# EAGLE design MS5803-02BA (EAGLE 9.1.3)
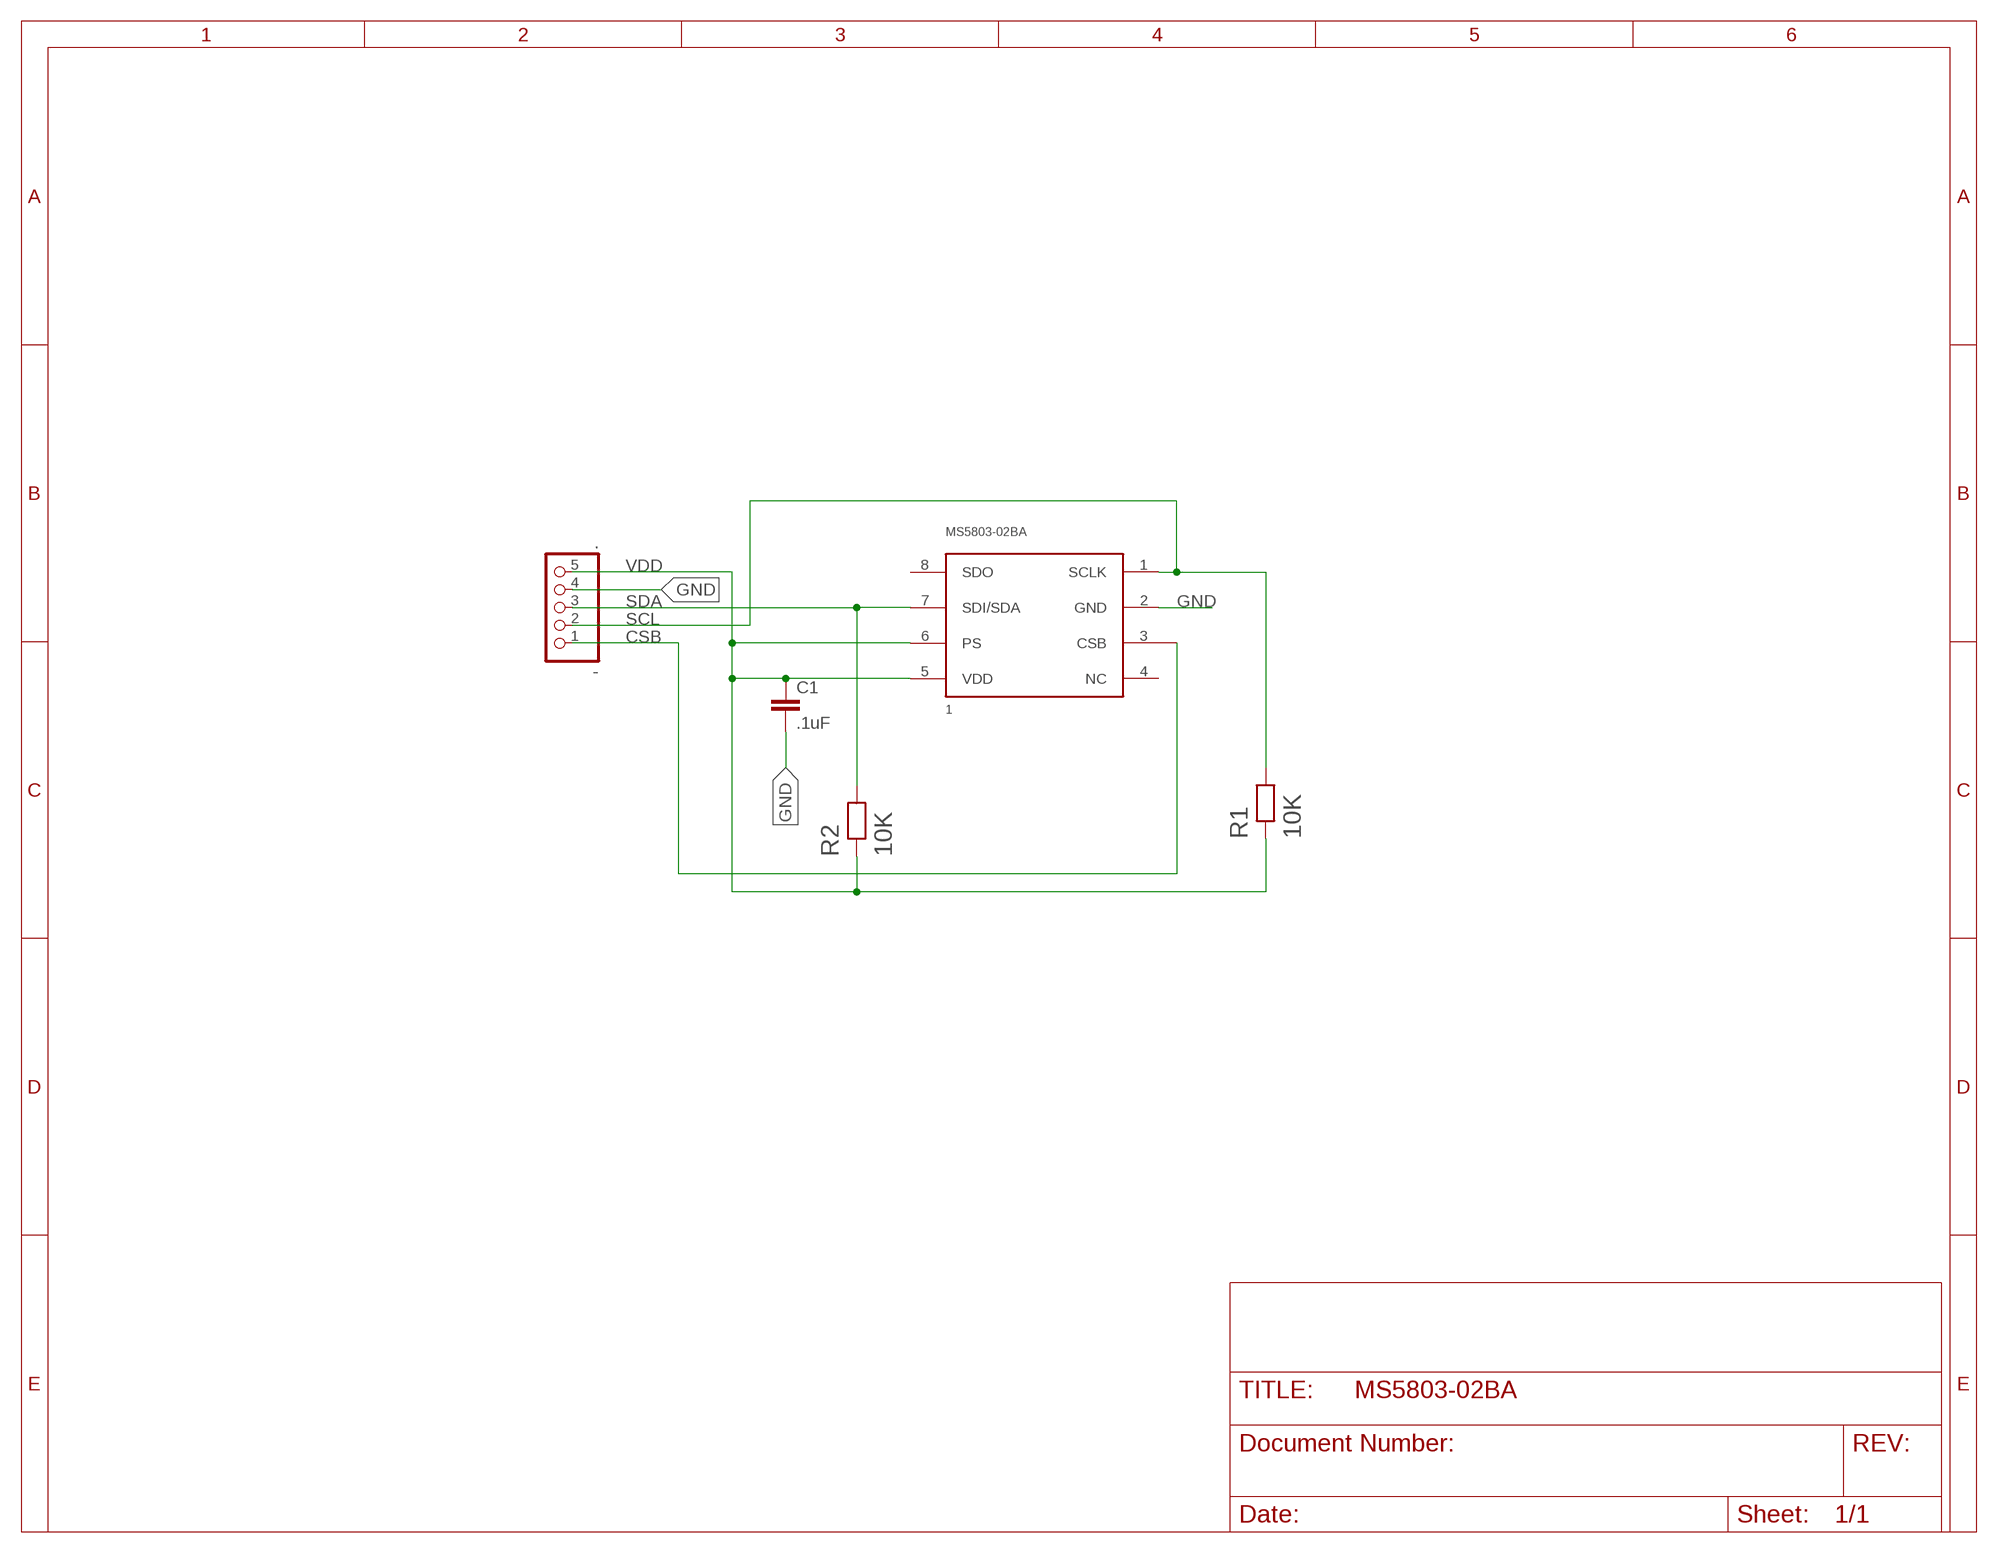
[diagram p0: schematic, sheet 1]

## Parts
-  .  PINHD-1X5  [1X05]
C1  .1uF  C-EUC0805  [C0805]
MS5803-02BA  1  MS5803-02BASMD  [MS5803-02BA]
R1  10K  10KOHM_2012(0805)_SMDSMD  [2012(0805)RESISTOR]
R2  10K  10KOHM_2012(0805)_SMDSMD  [2012(0805)RESISTOR]

## Nets
CSB: -.1 MS5803-02BA.3(CSB)
GND: -.4 C1.2 MS5803-02BA.2(GND)
SCL: -.2 MS5803-02BA.1(SCLK) R1.2
SDA: -.3 MS5803-02BA.7(SDI/SDA) R2.2
VDD: -.5 C1.1 MS5803-02BA.5(VDD) MS5803-02BA.6(PS) R1.1 R2.1
Unconnected: MS5803-02BA.4(NC) MS5803-02BA.8(SDO)

## Library data of the parts
- = pinhead:PINHD-1X5: PIN HEADER
C1 = rcl:C-EU: CAPACITOR, European symbol; SPICEPREFIX: C
MS5803-02BA = OPEnS_Lab_parts:MS5803-02BA: MS5803-02BA Miniature Altimeter Module Specifications High resolution module, 20cm Fast conversion down to 1ms Low power, 1uA (standby < 0.15 uA ) Integrated digital pressure sensor ( 24 bit ΔΣ ADC) Supply voltage 1.8 to 3.6 V Operating range: 300 to 110mbar, -40 to +85°C Extended Pressure Range: 10 to 2000mbar I2C and SPI interface (Mode 0, 3) No external components (Internal Oscillator) Excellent long term stability Hermetically sealable for outdoor devices The MS5803-02BA is a new generation of high resolution altimeter sensors from TE Connectivity with SPI and I2C bus interface. It is optimized for altimeters and variometers with an altitude resolution of 20 cm. The sensor module includes a high linearity pressure sensor and an ultra-low power 24 bit ΔΣ ADC with internal factory calibrated coefficients. It provides a precise digital 24 Bit pressure and temperature value and different operation modes that allow the user to optimize for conversion speed and current consumption. A high resolution temperature output allows the implementation of an altimeter/thermometer function without any additional sensor. The MS5803-02BA can be interfaced to virtually any microcontroller. The communication protocol is simple, without the need of programming internal registers in the device. The gel protection and antimagnetic stainless steel cap allows the use in 100m water resistant altimeter/compass watches. This new sensor module generation is based on leading MEMS technology and latest benefits from TE proven experience and know-how in high volume manufacturing of altimeter modules, which have been widely used for over a decade. The sensing principle employed leads to very low hysteresis and high stability of both pressure and temperature signal.
R1 R2 = OPEnS_Lab_parts:10KOHM_2012(0805)_SMD

## Board
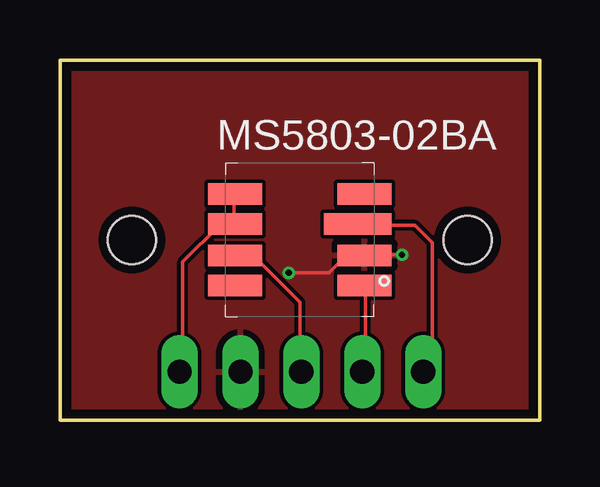
[diagram p1: board, top side]
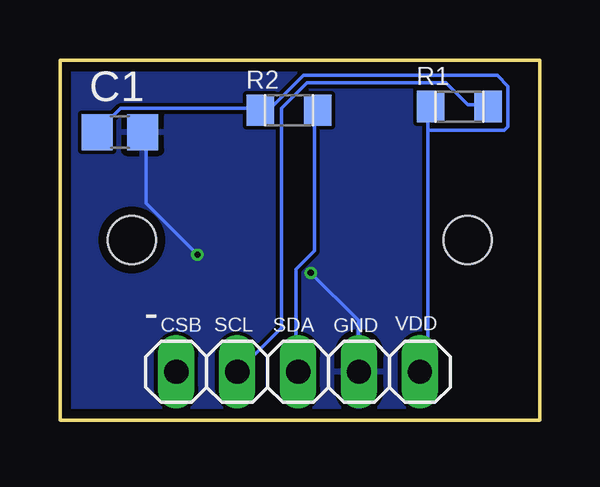
[diagram p2: board, bottom side, seen from below]

Size 20 x 15 mm. Coordinates in mm from the lower left corner, seen from the top.
Outline: 20,0 20,15 0,15 0,0 20,0
Copper layers (1*16): Top 0.035559375mm / dielectric 1.6mm / Bottom 0.035559375mm
Design rules "oshpark-2layer": minimum track width 6mil, minimum drill 10mil, track to track 6mil, track to pad 6mil, pad to pad 6mil, via to via 6mil, smd to smd 6mil, copper to edge 15mil, drill to drill 6mil, minimum pad ring 5mil, minimum via ring 5mil, stop-mask expansion 2.5mil, vias tented up to drill 0mil, thermal gap 10mil
Holes 2 mm at 3,7.5 17,7.5

### Footprints (pad centres in the part's own frame; a part is rotated, then mirrored left to right if it is on the bottom)
1X05 = drill 1.016 long: 1 -5.08,0; 2 -2.54,0; 3 0,0; 4 2.54,0; 5 5.08,0
C0805 = smd 1.3 x 1.5: 1 -0.95,0; 2 0.95,0
MS5803-02BA = smd 2.25 x 0.9: 1 2.7,-1.9; 2 2.7,-0.65; 4 2.7,1.9; 5 -2.7,1.9; 6 -2.7,0.65; 7 -2.7,-0.65; 8 -2.7,-1.9 | smd 2.8 x 0.9: 3 2.42,0.65
2012(0805)RESISTOR = smd 1.15 x 1.3: 1 -1.2,0; 2 1.2,0

### Placement (x,y rotation side)
-  10.07,2.01 0 bottom
C1  17.5,12 0 bottom
MS5803-02BA  10,7.51 0 top
R1  3.34,13.06 0 bottom
R2  10.45,12.91 0 bottom

### Tracks (layer width: path | path; a pad name or v marks a point on that pad's centre or on a via)
CSB
  Top 0.152: MS5803-02BA.3 12.44,8.11 14.81,8.11 15.53,7.39 15.53,2.39 -.1
GND  (via drill 0.25)
  Top 0.152: v14.27,6.89 12.74,6.89 MS5803-02BA.2 12.59,6.74 11.83,6.74 11.22,6.13 v9.54,6.13
  Bottom 0.152: v14.27,6.89 16.4,9.02 16.4,11.92 C1.2 | v9.54,6.13 7.56,4.15 7.56,2.01 -.4
  pour Top: 0,15 20,15 20,0 0,0
  pour Bottom: 0,15 20,15 20,0 0,0
SCL
  Top 0.152: MS5803-02BA.1 12.74,5.52 12.74,2.01 -.2
  Bottom 0.152: R1.2 2.23,13.14 2.99,13.14 3.9,14.05 9.7,14.05 10.76,12.99 10.76,3.84 12.59,2.01 -.2
SDA
  Top 0.152: MS5803-02BA.7 7.41,6.74 8.17,6.74 10,4.91 10,2.01 -.3
  Bottom 0.152: R2.2 9.39,12.83 9.39,7.04 10.15,6.28 10.15,2.01 -.3
VDD
  Top 0.152: MS5803-02BA.5 7.26,9.33 7.26,8.26 MS5803-02BA.6 7.26,8.11 6.65,8.11 5.12,6.59 5.12,2.01 -.5
  Bottom 0.152: C1.1 18.38,12.07 17.47,12.99 11.68,12.99 R2.1 11.52,12.99 11.22,12.99 9.85,14.36 1.77,14.36 1.31,13.9 1.31,12.22 1.47,12.07 4.67,12.07 | 4.67,12.07 4.67,2.32 4.97,2.01 -.5 | 4.67,12.07 4.67,12.99 R1.1

### Text on the board
bPlace: VDD | GND | SDA | SCL | CSB